# EAGLE design MonoShield_v1 (EAGLE 5.02)
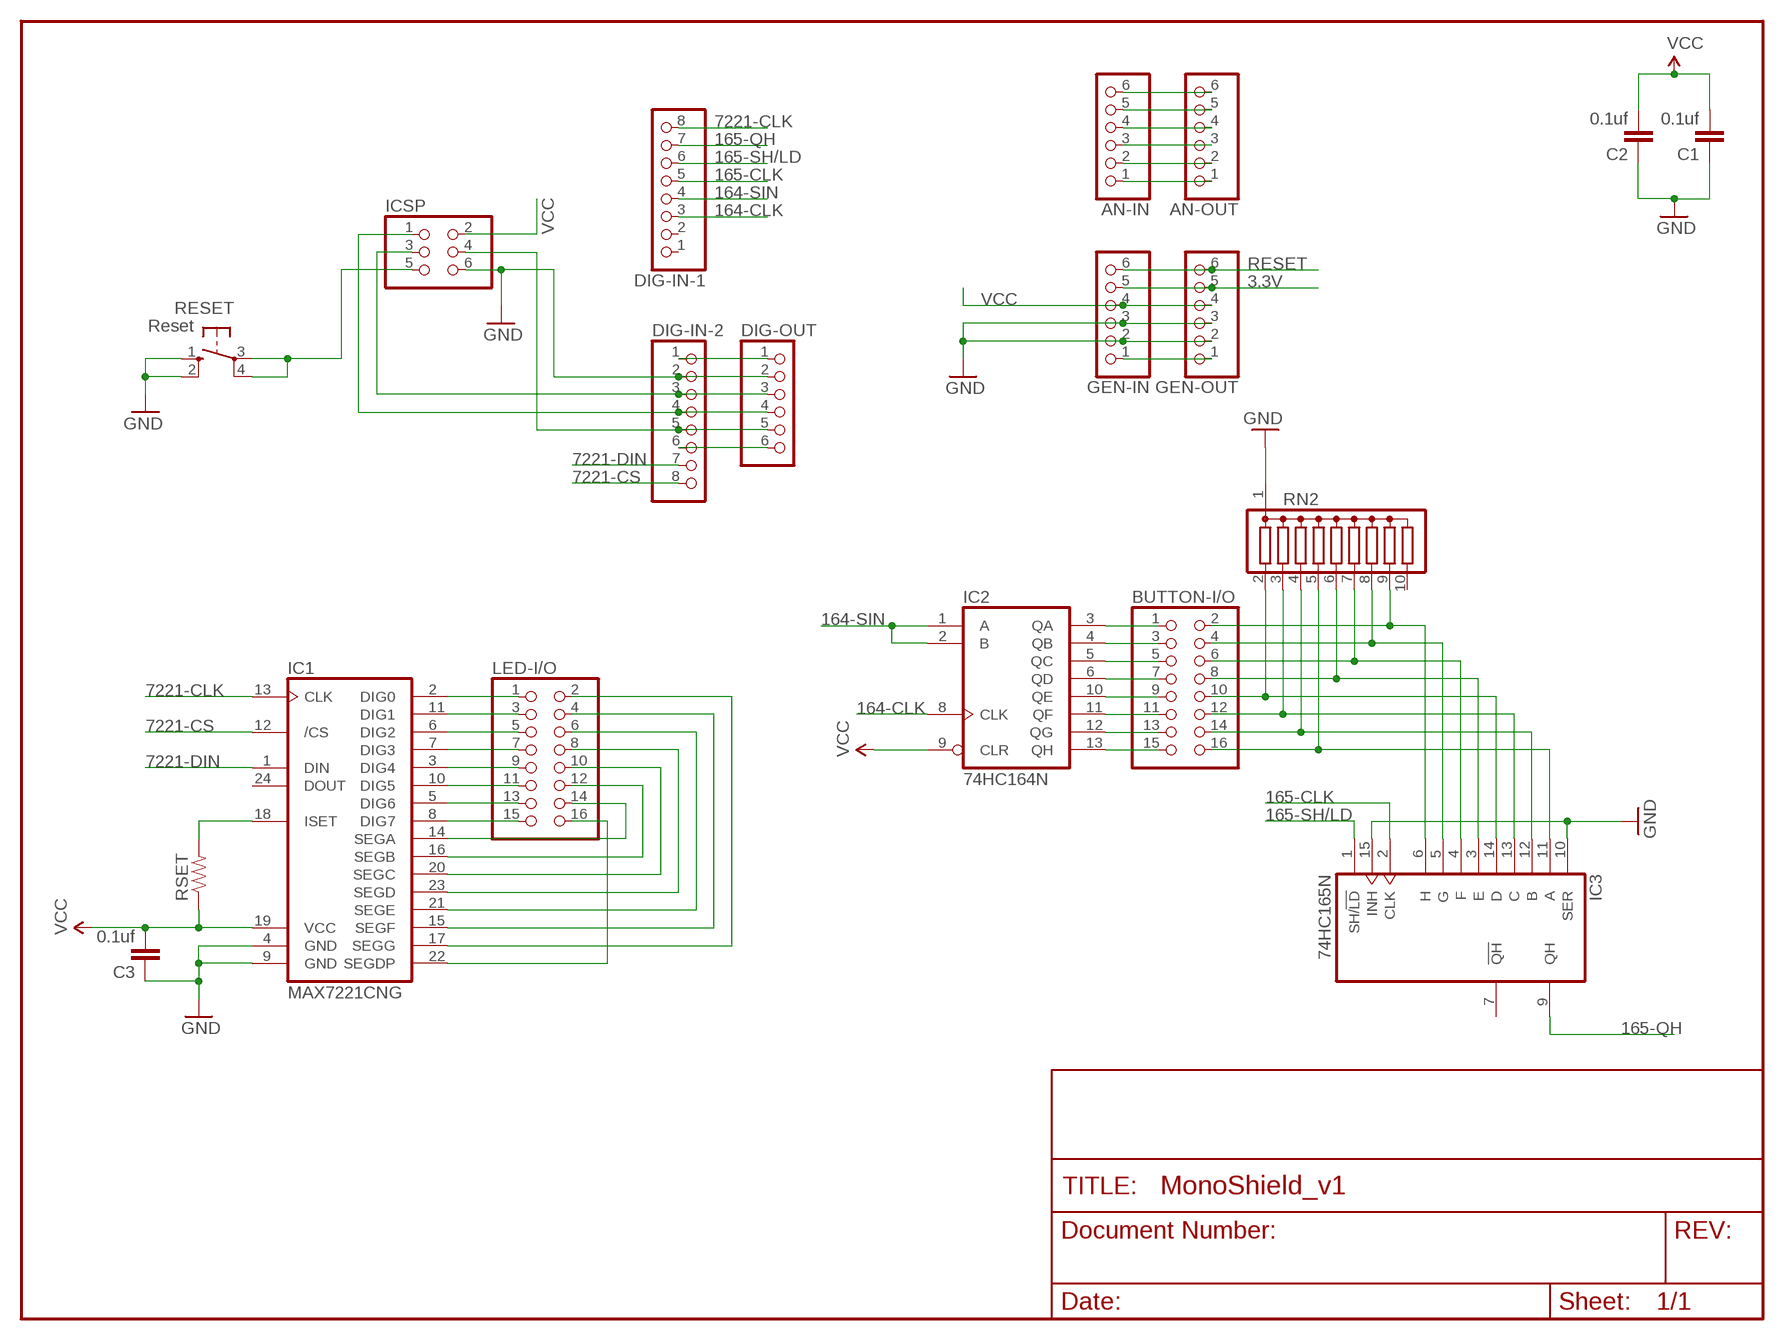
[diagram p0: schematic, sheet 1]

## Parts
AN-IN  PINHD-1X6CB  [1X06-CLEANBIG]
AN-OUT  PINHD-1X6B  [1X06-BIG]
BUTTON-I/O  PINHD-2X8  [2X08]
C1  0.1uf  CAPPTH2  [CAP-PTH-SMALL2]
C2  0.1uf  CAPPTH2  [CAP-PTH-SMALL2]
C3  0.1uf  CAPPTH2  [CAP-PTH-SMALL2]
DIG-IN-1  PINHD-1X8CLEANBIG  [1X08-CLEANBIG]
DIG-IN-2  PINHD-1X8CLEANBIG  [1X08-CLEANBIG]
DIG-OUT  PINHD-1X6B  [1X06-BIG]
GEN-IN  PINHD-1X6CB  [1X06-CLEANBIG]
GEN-OUT  PINHD-1X6B  [1X06-BIG]
IC1  MAX7221CNG  [DIL24-3]
IC2  74HC164N  [DIL14]
IC3  74HC165N  [DIL16]
ICSP  PINHD-2X3  [2X03]
LED-I/O  PINHD-2X8  [2X08]
RESET  Reset  10-XX  [B3F-10XX]
RN2  G09R  [SIL10]
RSET  RESISTORPTH1  [AXIAL-0.3]

## Nets
3.3V: GEN-IN.5 GEN-OUT.5
164-CLK: DIG-IN-1.3 IC2.8(CLK)
164-SIN: DIG-IN-1.4 IC2.1(A) IC2.2(B)
165-CLK: DIG-IN-1.5 IC3.2(CLK)
165-QH: DIG-IN-1.7 IC3.9(QH)
165-SH/LD: DIG-IN-1.6 IC3.1(SH/!LD)
7221-CLK: DIG-IN-1.8 IC1.13(CLK)
7221-CS: DIG-IN-2.8 IC1.12(/CS)
7221-DIN: DIG-IN-2.7 IC1.1(DIN)
GND: C1.1 C2.1 C3.1 DIG-IN-2.2 DIG-OUT.2 GEN-IN.2 GEN-IN.3 GEN-OUT.2 GEN-OUT.3 IC1.4(GND) IC1.9(GND) IC3.10(SER) IC3.15(INH) ICSP.6 RESET.1(S) RESET.2(S1) RN2.1
N$1: AN-IN.3 AN-OUT.3
N$2: DIG-IN-2.3 DIG-OUT.3 ICSP.3
N$3: DIG-IN-2.1 DIG-OUT.1
N$4: DIG-IN-2.4 DIG-OUT.4 ICSP.1
N$5: DIG-IN-2.5 DIG-OUT.5 ICSP.4
N$6: IC1.2(DIG0) LED-I/O.1
N$7: DIG-IN-2.6 DIG-OUT.6
N$8: IC1.18(ISET) RSET.P$2
N$9: BUTTON-I/O.1 IC2.3(QA)
N$10: IC1.22(SEGDP) LED-I/O.16
N$11: IC1.14(SEGA) LED-I/O.14
N$12: IC1.16(SEGB) LED-I/O.12
N$13: IC1.11(DIG1) LED-I/O.3
N$14: IC1.6(DIG2) LED-I/O.5
N$15: GEN-IN.1 GEN-OUT.1
N$16: IC1.7(DIG3) LED-I/O.7
N$17: IC1.3(DIG4) LED-I/O.9
N$18: IC1.10(DIG5) LED-I/O.11
N$19: IC1.5(DIG6) LED-I/O.13
N$20: IC1.8(DIG7) LED-I/O.15
N$21: IC1.20(SEGC) LED-I/O.10
N$22: IC1.23(SEGD) LED-I/O.8
N$23: IC1.21(SEGE) LED-I/O.6
N$24: IC1.15(SEGF) LED-I/O.4
N$25: IC1.17(SEGG) LED-I/O.2
N$26: BUTTON-I/O.2 IC3.6(H) RN2.9
N$27: BUTTON-I/O.4 IC3.5(G) RN2.8
N$28: BUTTON-I/O.6 IC3.4(F) RN2.7
N$29: BUTTON-I/O.8 IC3.3(E) RN2.6
N$30: BUTTON-I/O.10 IC3.14(D) RN2.2
N$31: BUTTON-I/O.12 IC3.13(C) RN2.3
N$32: BUTTON-I/O.14 IC3.12(B) RN2.4
N$33: BUTTON-I/O.16 IC3.11(A) RN2.5
N$39: BUTTON-I/O.3 IC2.4(QB)
N$40: BUTTON-I/O.5 IC2.5(QC)
N$41: BUTTON-I/O.7 IC2.6(QD)
N$42: BUTTON-I/O.9 IC2.10(QE)
N$43: BUTTON-I/O.11 IC2.11(QF)
N$44: BUTTON-I/O.13 IC2.12(QG)
N$45: BUTTON-I/O.15 IC2.13(QH)
N$154: AN-IN.1 AN-OUT.1
N$164: AN-IN.2 AN-OUT.2
N$182: AN-IN.4 AN-OUT.4
N$183: AN-IN.5 AN-OUT.5
N$184: AN-IN.6 AN-OUT.6
RESET: GEN-IN.6 GEN-OUT.6 ICSP.5 RESET.3(P) RESET.4(P1)
VCC: C1.2 C2.2 C3.2 GEN-IN.4 GEN-OUT.4 IC1.19(VCC) IC2.9(CLR) ICSP.2 RSET.P$1
Unconnected: DIG-IN-1.1 DIG-IN-1.2 IC1.24(DOUT) IC3.7(!QH) RN2.10

## Power pins joined to a net without a drawn wire
GND: IC2.7(GND) IC3.8(GND)
VCC: IC2.14(VCC) IC3.16(VCC)

## Library data of the parts
AN-IN AN-OUT DIG-OUT GEN-IN GEN-OUT = carduino:PINHD-1X6: PIN HEADER
BUTTON-I/O LED-I/O = pinhead:PINHD-2X8: PIN HEADER
C1-C3 = SparkFun:CAP: Capacitor Standard 0603 ceramic capacitor, and 0.1" leaded capacitor.
DIG-IN-1 DIG-IN-2 = carduino:PINHD-1X8: PIN HEADER
IC1 = maxim-10:MAX7221*: Serially Interfaced, 8-Digit LED Display Drivers
IC2 = 74xx-eu:74*164: 8-bit parallel out SHIFT REGISTER
IC3 = 74xx-eu:74*165: 8-bit parallel load SHIFT REGISTER
ICSP = pinhead:PINHD-2X3: PIN HEADER
RESET = switch-omron:10-XX: OMRON SWITCH
RN2 = resistor-sil:G09R: SIL RESISTOR
RSET = SparkFun:RESISTOR: Resistor Basic schematic elements and footprints for 0603, 1206, and PTH 1/10th watt (small) resistors.

## Board
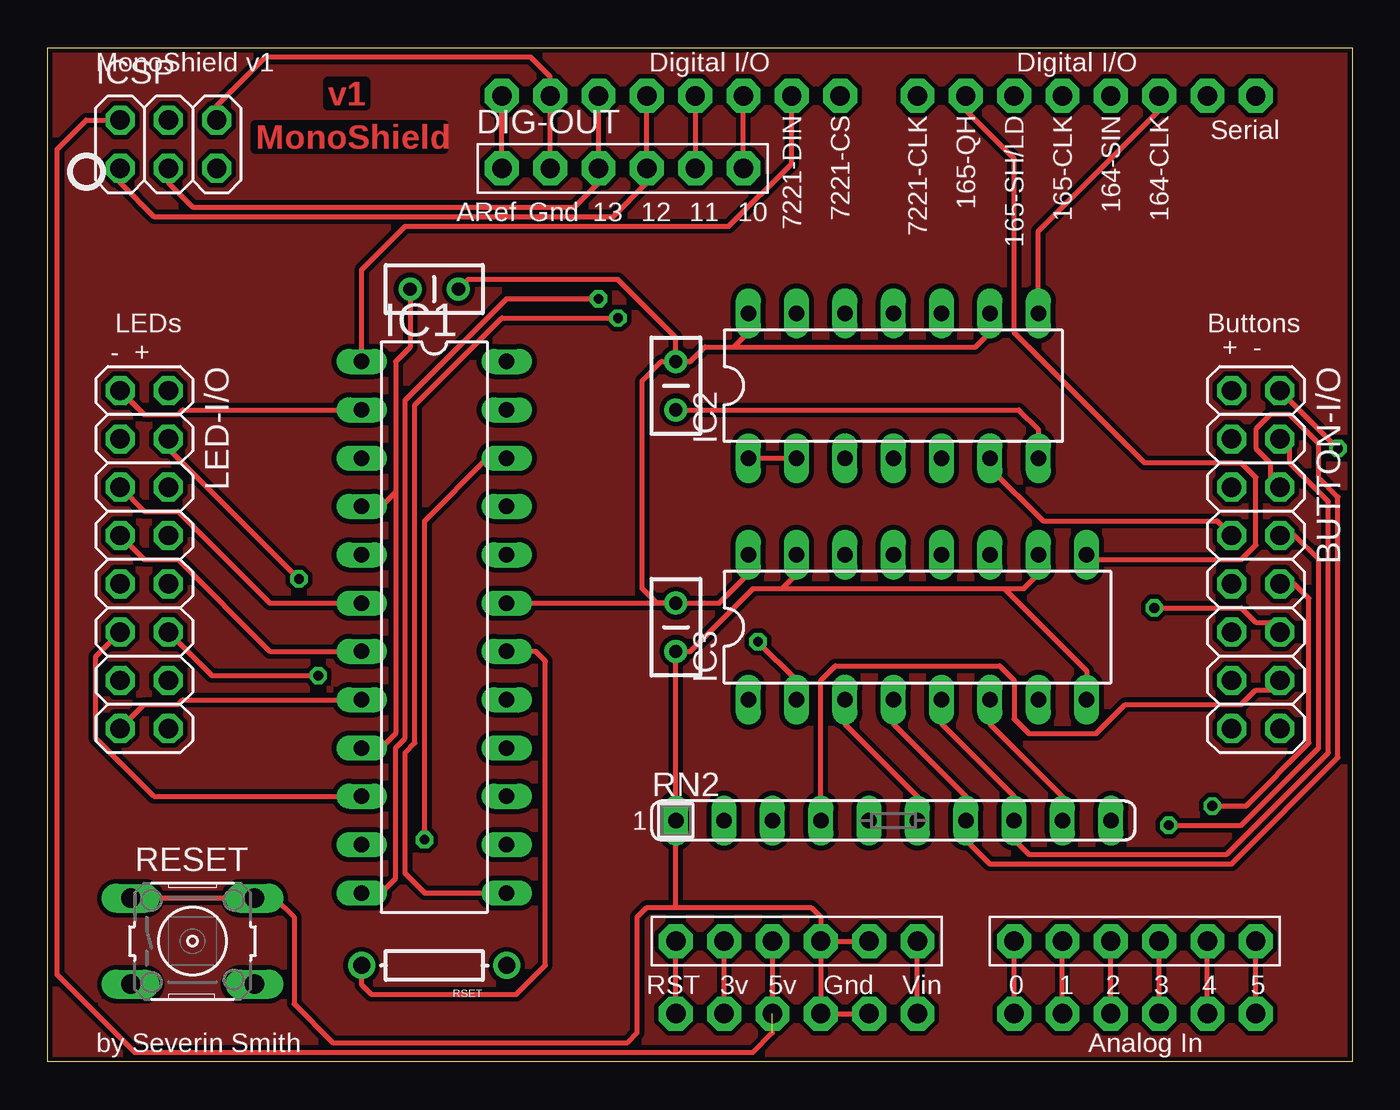
[diagram p1: board, top side]
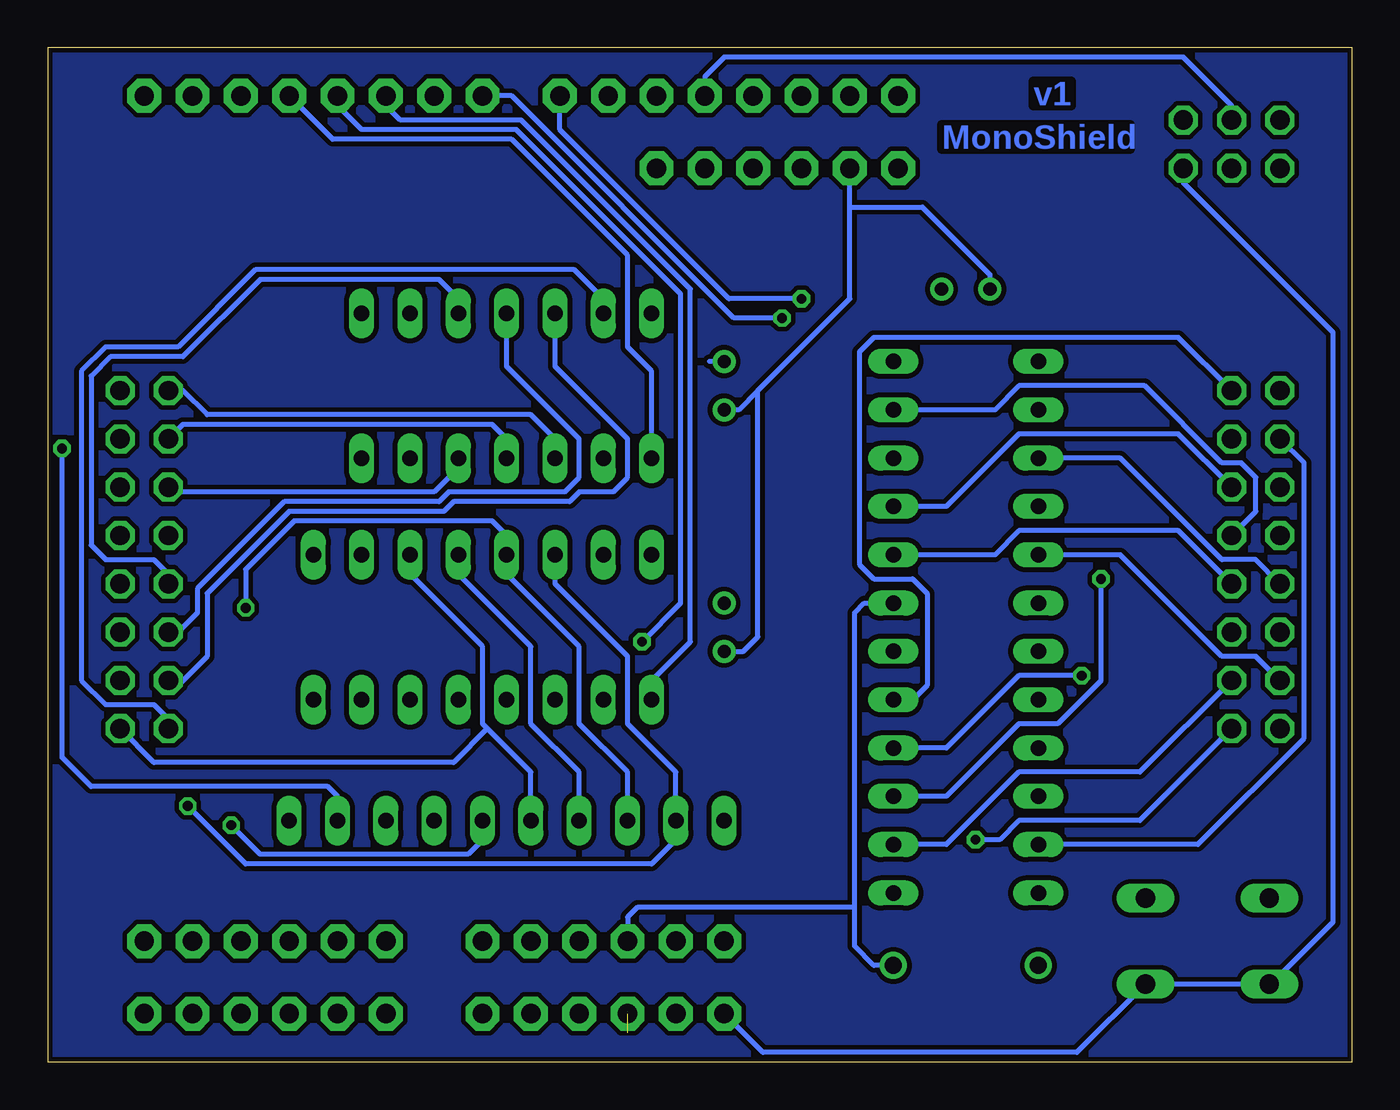
[diagram p2: board, bottom side, seen from below]

Size 68.58 x 53.34 mm. Coordinates in mm from the lower left corner, seen from the top.
Outline: 0,0 0,53.34 68.58,53.34 68.58,0 0,0
Copper layers (1*16): Top 0.035mm / dielectric 1.5mm / Bottom 0.035mm
Design rules "default *": minimum track width 10mil, minimum drill 19mil, track to track 10mil, track to pad 10mil, pad to pad 10mil, via to via 10mil, smd to smd 0mil, copper to edge 10mil, drill to drill 8mil, minimum pad ring 10mil, minimum via ring 8mil, stop-mask expansion 4mil, vias tented up to drill 0mil, thermal gap 10mil

### Footprints (pad centres in the part's own frame; a part is rotated, then mirrored left to right if it is on the bottom)
1X06-CLEANBIG = drill 1.016 pad 1.778 octagon: 1 -6.35,0; 2 -3.81,0; 3 -1.27,0; 4 1.27,0; 5 3.81,0; 6 6.35,0
1X06-BIG = drill 1.016 pad 1.778 octagon: 1 -6.35,0; 2 -3.81,0; 3 -1.27,0; 4 1.27,0; 5 3.81,0; 6 6.35,0
2X08 = drill 1.016 octagon: 1 -8.89,-1.27; 2 -8.89,1.27; 3 -6.35,-1.27; 4 -6.35,1.27; 5 -3.81,-1.27; 6 -3.81,1.27; 7 -1.27,-1.27; 8 -1.27,1.27; 9 1.27,-1.27; 10 1.27,1.27; 11 3.81,-1.27; 12 3.81,1.27; 13 6.35,-1.27; 14 6.35,1.27; 15 8.89,-1.27; 16 8.89,1.27
CAP-PTH-SMALL2 = drill 0.7 round: 1 0,0; 2 2.54,0
1X08-CLEANBIG = drill 1.016 pad 1.778 octagon: 1 -8.89,0; 2 -6.35,0; 3 -3.81,0; 4 -1.27,0; 5 1.27,0; 6 3.81,0; 7 6.35,0; 8 8.89,0
DIL24-3 = drill 0.813 long: 1 -13.97,-3.81; 2 -11.43,-3.81; 3 -8.89,-3.81; 4 -6.35,-3.81; 5 -3.81,-3.81; 6 -1.27,-3.81; 7 1.27,-3.81; 8 3.81,-3.81; 9 6.35,-3.81; 10 8.89,-3.81; 11 11.43,-3.81; 12 13.97,-3.81; 13 13.97,3.81; 14 11.43,3.81; 15 8.89,3.81; 16 6.35,3.81; 17 3.81,3.81; 18 1.27,3.81; 19 -1.27,3.81; 20 -3.81,3.81; 21 -6.35,3.81; 22 -8.89,3.81; 23 -11.43,3.81; 24 -13.97,3.81
DIL14 = drill 0.813 long: 1 -7.62,-3.81; 2 -5.08,-3.81; 3 -2.54,-3.81; 4 0,-3.81; 5 2.54,-3.81; 6 5.08,-3.81; 7 7.62,-3.81; 8 7.62,3.81; 9 5.08,3.81; 10 2.54,3.81; 11 0,3.81; 12 -2.54,3.81; 13 -5.08,3.81; 14 -7.62,3.81
DIL16 = drill 0.813 long: 1 -8.89,-3.81; 2 -6.35,-3.81; 3 -3.81,-3.81; 4 -1.27,-3.81; 5 1.27,-3.81; 6 3.81,-3.81; 7 6.35,-3.81; 8 8.89,-3.81; 9 8.89,3.81; 10 6.35,3.81; 11 3.81,3.81; 12 1.27,3.81; 13 -1.27,3.81; 14 -3.81,3.81; 15 -6.35,3.81; 16 -8.89,3.81
2X03 = drill 1.016 octagon: 1 -2.54,-1.27; 2 -2.54,1.27; 3 0,-1.27; 4 0,1.27; 5 2.54,-1.27; 6 2.54,1.27
B3F-10XX = drill 1.016 long: 1 -3.251,2.261; 2 3.251,2.261; 3 -3.251,-2.261; 4 3.251,-2.261
SIL10 = drill 0.813 long: 1 -11.43,0; 2 -8.89,0; 3 -6.35,0; 4 -3.81,0; 5 -1.27,0; 6 1.27,0; 7 3.81,0; 8 6.35,0; 9 8.89,0; 10 11.43,0
AXIAL-0.3 = drill 0.9 round: P$1 -3.81,0; P$2 3.81,0

### Placement (x,y rotation side)
AN-IN  57.15,2.54 0 top
AN-OUT  57.15,6.35 0 top
BUTTON-I/O  63.5,26.42 270 top
C1  19.05,40.64 0 top
C2  33.02,34.29 90 top
C3  33.02,21.59 90 top
DIG-IN-1  54.61,50.8 180 top
DIG-IN-2  32.77,50.8 0 top
DIG-OUT  30.23,46.99 0 top
GEN-IN  39.37,2.54 180 top
GEN-OUT  39.37,6.35 180 top
IC1  20.32,22.86 270 top
IC2  44.45,35.56 0 top
IC3  45.72,22.86 0 top
ICSP  6.35,48.26 0 top
LED-I/O  5.08,26.42 270 top
RESET  7.62,6.35 0 top
RN2  44.45,12.7 0 top
RSET  20.32,5.08 180 top

### Tracks (layer width: path | path; a pad name or v marks a point on that pad's centre or on a via)
3.3V
  Top 0.254: GEN-IN.5 GEN-OUT.5
164-CLK
  Top 0.254: IC2.8 52.07,43.69 58.42,50.04 DIG-IN-1.3
164-SIN
  Top 0.254: IC2.1 IC2.2
  Bottom 0.254: DIG-IN-1.4 53.59,48.51 44.2,48.51 38.1,42.42 38.1,37.59 36.83,36.32 IC2.1
165-CLK  (via drill 0.51)
  Top 0.254: v37.34,22.1 39.37,20.07 IC3.2
  Bottom 0.254: v37.34,22.1 35.31,24.13 35.31,40.39 43.94,49.02 52.07,49.02 53.34,50.29 DIG-IN-1.5
165-QH
  Top 0.254: IC3.9 54.86,26.42 62.74,26.42 63.5,27.18 63.5,30.73 62.74,31.5 57.66,31.5 50.8,38.35 50.8,47.5 48.26,50.04 DIG-IN-1.7
165-SH/LD
  Bottom 0.254: IC3.1 36.83,20.07 34.8,22.1 34.8,40.64 43.69,49.53 50.04,49.53 50.8,50.29 DIG-IN-1.6
7221-CLK  (via drill 0.51)
  Top 0.254: v29.97,39.12 23.88,39.12 19.3,34.54 19.3,16.76 18.8,16.26 18.8,9.91 19.81,8.89 IC1.13
  Bottom 0.254: v29.97,39.12 32.51,39.12 44.2,50.8 DIG-IN-1.8
7221-CS  (via drill 0.51)
  Top 0.254: v28.96,40.13 24.13,40.13 18.8,34.8 18.8,17.02 18.29,16.51 18.29,9.65 17.53,8.89 IC1.12
  Bottom 0.254: DIG-IN-2.8 41.66,49.02 32.77,40.13 v28.96,40.13
7221-DIN
  Top 0.254: IC1.1 16.51,41.66 18.8,43.94 35.81,43.94 39.12,47.24 DIG-IN-2.7
GND
  Top 0.254: GEN-IN.2 GEN-IN.3 GEN-OUT.3 | GEN-OUT.3 GEN-OUT.2 | ICSP.6 8.89,50.29 11.43,52.83 25.4,52.83 26.42,51.82 DIG-IN-2.2 DIG-OUT.2 | C1.1 19.05,37.59 18.29,36.83 18.29,29.97 | IC2.7 52.07,33.27 51.05,34.29 C2.1 | 38.35,24.89 37.08,24.89 33.78,21.59 C3.1 RN2.1 33.02,8.13 | 38.35,24.89 38.61,24.89 39.37,25.65 IC3.15 | 38.35,24.89 50.29,24.89 | 50.29,24.89 51.31,24.89 52.07,25.65 IC3.10 | 50.29,24.89 54.61,20.57 IC3.8 | GEN-OUT.3 40.64,7.62 40.13,8.13 33.02,8.13 | 33.02,8.13 31.5,8.13 30.99,7.62 30.99,1.52 30.48,1.02 14.99,1.02 12.95,3.05 12.95,7.62 11.94,8.64 10.92,8.64 | RESET.1 4.34,8.61 4.32,8.64 10.92,8.64 | RESET.2 10.9,8.61 10.92,8.64 | 18.29,29.97 18.29,17.27 17.53,16.51 IC1.9 | IC1.4 17.53,29.21 18.29,29.97
  Bottom 0.254: C1.1 19.05,41.4 22.61,44.96 26.42,44.96 | 26.42,44.96 DIG-OUT.2 | 26.42,44.96 26.42,40.13 31.24,35.31 | 31.24,35.31 32.26,34.29 C2.1 | C3.1 32,21.59 31.24,22.35 31.24,35.31
N$1
  Top 0.254: AN-IN.3 AN-OUT.3
N$2
  Top 0.254: DIG-IN-2.3 DIG-OUT.3 28.96,46.23 27.69,44.96 7.62,44.96 6.35,46.23 ICSP.3
N$3
  Top 0.254: DIG-OUT.1 DIG-IN-2.1
N$4
  Top 0.254: DIG-IN-2.4 DIG-OUT.4 31.5,46.23 29.72,44.45 5.59,44.45 3.81,46.23 ICSP.1
N$5
  Top 0.254: DIG-IN-2.5 DIG-OUT.5
  Bottom 0.254: ICSP.4 6.35,50.29 8.89,52.83 33.02,52.83 34.04,51.82 DIG-IN-2.5
N$6
  Top 0.254: 16,34.29 IC1.2 | 16,34.29 15.24,34.29 | LED-I/O.1 5.08,34.04 6.86,34.04 7.11,34.29 16,34.29
N$7
  Top 0.254: DIG-OUT.6 DIG-IN-2.6
N$8
  Top 0.254: RSET.P$2 16.51,4.06 17.02,3.56 24.64,3.56 26.16,5.08 26.16,21.08 25.65,21.59 IC1.18
N$9
  Bottom 0.254: IC2.3 41.91,32.77 43.18,34.04 60.2,34.04 61.47,35.31 BUTTON-I/O.1
N$10  (via drill 0.51)
  Top 0.254: IC1.22 23.11,31.75 19.81,28.45 v19.81,11.68
  Bottom 0.254: v19.81,11.68 18.54,11.68 17.53,12.7 11.18,12.7 LED-I/O.16
N$11
  Bottom 0.254: IC1.14 21.34,11.43 17.53,15.24 11.18,15.24 LED-I/O.14
N$12  (via drill 0.51)
  Top 0.254: v14.22,20.32 8.64,20.32 LED-I/O.12
  Bottom 0.254: v14.22,20.32 17.53,20.32 21.34,16.51 IC1.16
N$13
  Bottom 0.254: IC1.11 8.13,11.43 2.54,17.02 2.54,31.5 LED-I/O.3
N$14
  Top 0.254: IC1.6 11.68,24.13 6.86,28.96 5.08,28.96 LED-I/O.5
N$15
  Top 0.254: GEN-IN.1 GEN-OUT.1
N$16
  Top 0.254: IC1.7 11.68,21.59 6.86,26.42 5.08,26.42 LED-I/O.7
N$17
  Bottom 0.254: IC1.3 12.19,31.75 6.86,26.42 5.08,26.42 LED-I/O.9
N$18
  Top 0.254: IC1.10 5.59,13.97 2.54,17.02 2.54,21.34 LED-I/O.11
N$19
  Bottom 0.254: IC1.5 12.19,26.67 6.86,21.34 5.08,21.34 LED-I/O.13
N$20
  Top 0.254: LED-I/O.15 5.08,18.8 6.86,18.8 7.11,19.05 IC1.8
N$21
  Bottom 0.254: IC1.20 18.8,26.67 17.53,27.94 9.14,27.94 LED-I/O.10
N$22
  Bottom 0.254: IC1.23 18.8,34.29 17.53,35.56 10.92,35.56 6.86,31.5 5.84,31.5 5.08,30.73 5.08,28.96 LED-I/O.8
N$23
  Bottom 0.254: IC1.21 21.34,29.21 17.53,33.02 9.14,33.02 LED-I/O.6
N$24  (via drill 0.51)
  Top 0.254: v13.21,25.4 6.35,32.26 LED-I/O.4
  Bottom 0.254: v13.21,25.4 13.21,20.07 15.49,17.78 17.53,17.78 21.34,13.97 IC1.15
N$25
  Bottom 0.254: IC1.17 23.11,19.05 22.35,19.81 22.35,24.64 23.11,25.4 25.15,25.4 25.91,26.16 25.91,37.34 25.15,38.1 9.14,38.1 LED-I/O.2
N$26  (via drill 0.51)
  Top 0.254: RN2.9 53.34,13.97 49.53,17.78 IC3.6 | v67.82,32.26 BUTTON-I/O.2
  Bottom 0.254: v67.82,32.26 67.82,16 66.29,14.48 53.85,14.48 53.34,13.97 RN2.9
N$27
  Top 0.254: IC3.5 46.99,17.78 50.8,13.97 RN2.8 50.8,11.68 51.56,10.92 61.98,10.92 67.31,16.26 67.31,29.46 65.28,31.5 65.28,32.26 BUTTON-I/O.4
N$28
  Top 0.254: IC3.4 44.45,17.78 48.26,13.97 RN2.7 48.26,11.68 49.53,10.41 62.23,10.41 67.82,16 67.82,29.72 66.8,30.73 66.8,32.51 65.28,34.04 64.26,34.04 63.5,33.27 63.5,32.26 64.26,31.5 64.26,30.73 BUTTON-I/O.6
N$29  (via drill 0.51)
  Top 0.254: RN2.6 45.72,13.97 41.91,17.78 IC3.3 | v58.93,12.45 62.74,12.45 66.8,16.51 66.8,26.42 65.53,27.69 BUTTON-I/O.8
  Bottom 0.254: v58.93,12.45 57.4,10.92 46.48,10.92 45.72,11.68 RN2.6
N$30  (via drill 0.51)
  Top 0.254: v61.21,13.46 62.99,13.46 66.29,16.76 66.29,24.38 65.53,25.15 BUTTON-I/O.10
  Bottom 0.254: IC3.14 41.91,25.15 38.1,21.34 38.1,17.78 35.56,15.24 RN2.2 35.56,11.68 36.83,10.41 58.17,10.41 v61.21,13.46
N$31  (via drill 0.51)
  Top 0.254: v58.17,23.88 62.74,23.88 63.5,23.11 64.26,23.11 BUTTON-I/O.12
  Bottom 0.254: RN2.3 38.1,15.24 40.64,17.78 40.64,21.84 44.45,25.65 IC3.13 44.45,27.69 45.21,28.45 55.63,28.45 58.17,25.91 v58.17,23.88
N$32
  Top 0.254: BUTTON-I/O.14 64.26,19.56 63.5,19.56 62.74,18.8 56.64,18.8 55.12,17.27 51.56,17.27 50.8,18.03 50.8,20.07 50.04,20.83 41.4,20.83 40.64,20.07 RN2.4
  Bottom 0.254: RN2.4 40.64,15.24 43.18,17.78 43.18,21.84 46.99,25.65 IC3.12
N$33
  Bottom 0.254: 45.47,17.53 43.18,15.24 RN2.5 | 45.47,17.53 45.72,17.78 45.72,21.84 49.53,25.65 IC3.11 | 45.47,17.53 47.24,15.75 62.99,15.75 BUTTON-I/O.16
N$34
  pour Top (isolate 0.254): 0,53.34 0,0 68.58,0 68.58,53.34 2.29,53.34
N$35
  pour Top (isolate 0.254): 0,53.34 0,0.25 0,0 68.83,0 68.83,53.34 48.51,53.34
N$36
  pour Bottom: 0,53.34 0,0.25 0,0 68.58,0 68.58,53.34
N$39
  Bottom 0.254: IC2.4 44.45,32.77 45.21,33.53 61.47,33.53 BUTTON-I/O.3
N$40
  Bottom 0.254: IC2.5 46.99,31.24 48.26,29.97 61.98,29.97 BUTTON-I/O.5
N$41
  Top 0.254: IC2.6 49.53,31.24 52.32,28.45 61.47,28.45 BUTTON-I/O.7
N$42
  Bottom 0.254: IC2.10 46.99,40.13 48.01,41.15 57.4,41.15 61.47,37.08 65.28,37.08 66.29,36.07 66.29,27.18 65.53,26.42 62.99,26.42 62.23,25.65 BUTTON-I/O.9
N$43
  Bottom 0.254: IC2.11 44.45,36.58 40.64,32.77 40.64,30.73 41.4,29.97 47.5,29.97 48.01,29.46 56.13,29.46 60.71,24.89 60.71,23.62 61.72,22.61 BUTTON-I/O.11 61.98,22.61
N$44
  Bottom 0.254: IC2.12 41.91,36.58 38.1,32.77 38.1,30.73 38.86,29.97 40.64,29.97 41.15,29.46 47.24,29.46 47.75,28.96 55.88,28.96 60.2,24.64 60.2,21.34 61.72,19.81 61.72,20.07 BUTTON-I/O.13
N$45
  Bottom 0.254: IC2.13 39.37,40.13 40.89,41.66 57.66,41.66 61.72,37.59 65.53,37.59 66.8,36.32 66.8,20.07 65.53,18.8 62.99,18.8 62.23,18.03 BUTTON-I/O.15
N$154
  Top 0.254: AN-IN.1 AN-OUT.1
N$164
  Top 0.254: AN-IN.2 AN-OUT.2
N$182
  Top 0.254: AN-IN.4 AN-OUT.4
N$183
  Top 0.254: AN-IN.5 AN-OUT.5
N$184
  Top 0.254: AN-IN.6 AN-OUT.6
RESET
  Top 0.254: GEN-IN.6 GEN-OUT.6
  Bottom 0.254: ICSP.5 8.89,46.23 1.02,38.35 1.02,7.37 4.29,4.09 RESET.3 10.9,4.09 | GEN-IN.6 30.99,0.51 14.48,0.51 10.9,4.09 | 10.9,4.09 RESET.4
VCC  (1 unrouted)
  Top 0.254: C1.2 22.1,41.15 29.97,41.15 33.02,38.1 C2.2 33.78,36.83 | IC2.9 49.53,38.35 48.77,37.59 36.07,37.59 | 36.07,37.59 34.54,37.59 33.78,36.83 | IC2.14 36.83,38.35 36.07,37.59 | 33.78,36.83 32.26,36.83 31.24,35.81 31.24,24.89 32,24.13 C3.2 | IC1.19 C3.2 | C3.2 35.31,24.13 36.83,25.65 IC3.16 | GEN-OUT.4 GEN-IN.4 | 38.1,1.52 37.08,0.51 4.57,0.51 0.51,4.57 0.51,48.01 2.03,49.53 ICSP.2
  Bottom 0.254: C2.2 33.78,36.83 | RSET.P$1 25.15,5.08 26.16,6.1 26.16,8.13 | 26.16,8.13 26.16,23.62 25.65,24.13 IC1.19 | GEN-OUT.4 38.1,7.62 37.59,8.13 26.16,8.13

### Text on the board
Top: v1 | MonoShield
Bottom: v1 | MonoShield
tPlace: MonoShield v1 | Digital I/O | Digital I/O | 7221-DIN | 7221-CS | 7221-CLK | 165-QH | 165-SH/LD | 165-CLK | 164-SIN | 164-CLK | Serial | ARef | Gnd | 13 | 12 | 11 | 10 | LEDs | Buttons | - + | + - | RST | 3v | 5v | Gnd | Vin | 0 | 1 | 2 | 3 | 4 | 5 | Analog In | by Severin Smith